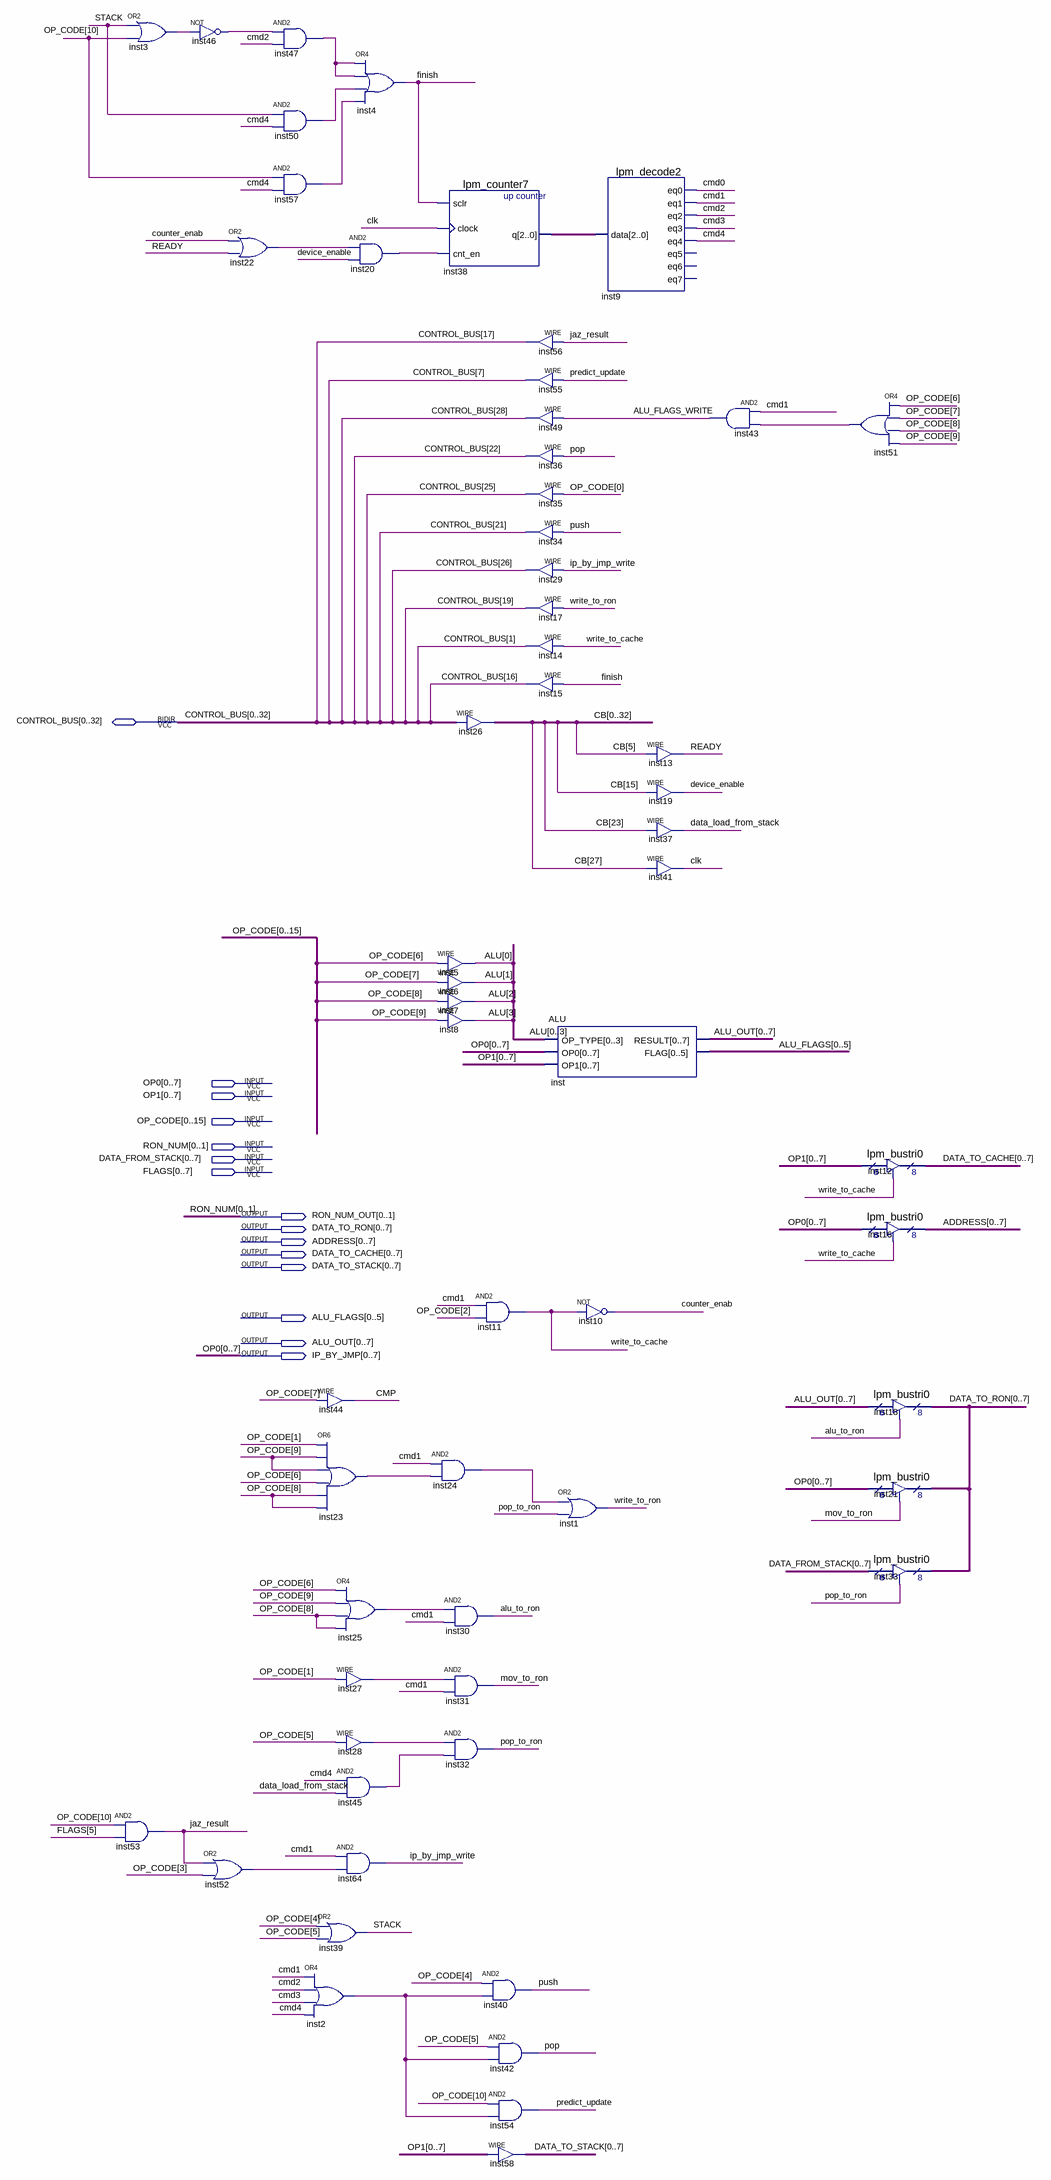
[diagram p0: schematic sheet]
// Quartus schematic EX.bdf as structural Verilog: 59 symbols, 15 pins
module EX (
  input  [0:7] OP0,
  input  [0:7] OP1,
  input  [0:15] OP_CODE,
  input  [0:1] RON_NUM,
  input  [0:7] DATA_FROM_STACK,
  input  [0:7] FLAGS,
  inout  [0:32] CONTROL_BUS,
  output [0:1] RON_NUM_OUT,
  output [0:7] DATA_TO_RON,
  output [0:7] ADDRESS,
  output [0:7] DATA_TO_CACHE,
  output [0:7] DATA_TO_STACK,
  output [0:5] ALU_FLAGS,
  output [0:7] ALU_OUT,
  output [0:7] IP_BY_JMP
);

  wire ALU_FLAGS_WRITE, alu_to_ron, clk, cmd0, cmd1, cmd2, cmd3, cmd4, CMP, counter_enab,
       data_load_from_stack, device_enable, finish, inst2_out, inst3_out, inst20_out, inst22_out, inst23_out,
       inst24_out, inst25_out, inst27_out, inst28_out, inst45_out, inst46_out, inst47_out, inst50_out,
       inst51_out, inst52_out, inst57_out, ip_by_jmp_write, jaz_result, mov_to_ron, pop, pop_to_ron,
       predict_update, push, READY, STACK, write_to_cache, write_to_ron;
  wire [2:0] inst38_q;
  wire [3:0] ALU;
  wire [32:0] CB;

  and inst53 (jaz_result, OP_CODE[10], FLAGS[5]);
  or inst3 (inst3_out, STACK, OP_CODE[10]);
  not inst46 (inst46_out, inst3_out);
  or inst52 (inst52_out, jaz_result, OP_CODE[3]);
  and inst47 (inst47_out, inst46_out, cmd2);
  and inst50 (inst50_out, STACK, cmd4);
  and inst57 (inst57_out, OP_CODE[10], cmd4);
  or inst22 (inst22_out, counter_enab, READY);
  assign CMP = OP_CODE[7];  // WIRE inst44
  or inst23 (inst23_out, OP_CODE[1], OP_CODE[9], OP_CODE[9], OP_CODE[6], OP_CODE[8], OP_CODE[8]);
  or inst39 (STACK, OP_CODE[4], OP_CODE[5]);
  or inst2 (inst2_out, cmd1, cmd2, cmd3, cmd4);
  or inst4 (finish, inst47_out, inst47_out, inst50_out, inst57_out);
  and inst20 (inst20_out, inst22_out, device_enable);
  or inst25 (inst25_out, OP_CODE[6], OP_CODE[9], OP_CODE[8], OP_CODE[8]);
  assign inst27_out = OP_CODE[1];  // WIRE inst27
  assign inst28_out = OP_CODE[5];  // WIRE inst28
  and inst45 (inst45_out, cmd4, data_load_from_stack);
  and inst64 (ip_by_jmp_write, cmd1, inst52_out);
  lpm_counter7 inst38 (.sclr(finish), .clock(clk), .cnt_en(inst20_out), .q(inst38_q));
  assign {CB[0], CB[1], CB[2], CB[3], CB[4], CB[5], CB[6], CB[7], CB[8], CB[9], CB[10], CB[11], CB[12], CB[13], CB[14], CB[15], CB[16], CB[17], CB[18], CB[19], CB[20], CB[21], CB[22], CB[23], CB[24], CB[25], CB[26], CB[27], CB[28], CB[29], CB[30], CB[31], CB[32]} = CONTROL_BUS;  // WIRE inst26
  assign ALU[0] = OP_CODE[6];  // WIRE inst5
  assign ALU[1] = OP_CODE[7];  // WIRE inst6
  assign ALU[2] = OP_CODE[8];  // WIRE inst7
  assign ALU[3] = OP_CODE[9];  // WIRE inst8
  and inst11 (write_to_cache, cmd1, OP_CODE[2]);
  and inst24 (inst24_out, cmd1, inst23_out);
  and inst30 (alu_to_ron, inst25_out, cmd1);
  and inst31 (mov_to_ron, inst27_out, cmd1);
  and inst32 (pop_to_ron, inst28_out, inst45_out);
  assign CONTROL_BUS[17] = jaz_result;  // WIRE inst56
  assign CONTROL_BUS[7] = predict_update;  // WIRE inst55
  assign CONTROL_BUS[28] = ALU_FLAGS_WRITE;  // WIRE inst49
  assign CONTROL_BUS[22] = pop;  // WIRE inst36
  assign CONTROL_BUS[25] = OP_CODE[0];  // WIRE inst35
  assign CONTROL_BUS[21] = push;  // WIRE inst34
  assign CONTROL_BUS[26] = ip_by_jmp_write;  // WIRE inst29
  assign CONTROL_BUS[19] = write_to_ron;  // WIRE inst17
  assign CONTROL_BUS[1] = write_to_cache;  // WIRE inst14
  assign CONTROL_BUS[16] = finish;  // WIRE inst15
  and inst40 (push, OP_CODE[4], inst2_out);
  and inst42 (pop, OP_CODE[5], inst2_out);
  and inst54 (predict_update, OP_CODE[10], inst2_out);
  assign DATA_TO_STACK = OP1;  // WIRE inst58
  ALU inst (.OP_TYPE({ALU[0], ALU[1], ALU[2], ALU[3]}), .OP0(OP0), .OP1(OP1), .RESULT(ALU_OUT), .FLAG(ALU_FLAGS));
  not inst10 (counter_enab, write_to_cache);
  or inst1 (write_to_ron, inst24_out, pop_to_ron);
  lpm_decode2 inst9 (
    .data(inst38_q), .eq0(cmd0), .eq1(cmd1), .eq2(cmd2), .eq3(cmd3), .eq4(cmd4));  // open: eq5, eq6, eq7
  assign READY = CB[5];  // WIRE inst13
  assign device_enable = CB[15];  // WIRE inst19
  assign data_load_from_stack = CB[23];  // WIRE inst37
  assign clk = CB[27];  // WIRE inst41
  and inst43 (ALU_FLAGS_WRITE, cmd1, inst51_out);
  or inst51 (inst51_out, OP_CODE[6], OP_CODE[7], OP_CODE[8], OP_CODE[9]);
  lpm_bustri0 inst12 (.enabledt(write_to_cache), .data(OP1), .tridata(DATA_TO_CACHE));
  lpm_bustri0 inst16 (.enabledt(write_to_cache), .data(OP0), .tridata(ADDRESS));
  lpm_bustri0 inst18 (.enabledt(alu_to_ron), .data(ALU_OUT), .tridata(DATA_TO_RON));
  lpm_bustri0 inst21 (.enabledt(mov_to_ron), .data(OP0), .tridata(DATA_TO_RON));
  lpm_bustri0 inst33 (.enabledt(pop_to_ron), .data(DATA_FROM_STACK), .tridata(DATA_TO_RON));

  assign IP_BY_JMP = OP0;
  assign RON_NUM_OUT = RON_NUM;
endmodule
